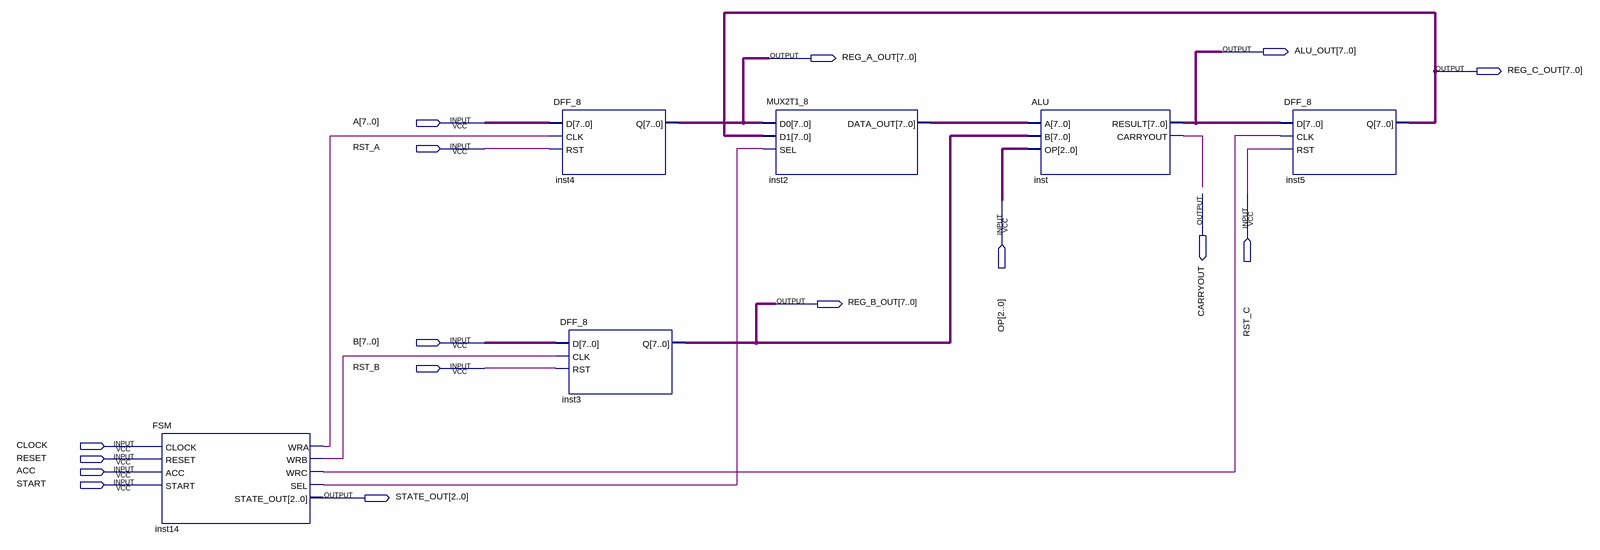
[diagram p0: schematic sheet]
// Quartus schematic DATA_FLOW.bdf as structural Verilog: 6 symbols, 16 pins
module DATA_FLOW (
  input  [7:0] A,
  input  RST_A,
  input  RST_C,
  input  [2:0] OP,
  input  [7:0] B,
  input  RST_B,
  input  CLOCK,
  input  RESET,
  input  ACC,
  input  START,
  output [7:0] ALU_OUT,
  output [7:0] REG_A_OUT,
  output [7:0] REG_C_OUT,
  output CARRYOUT,
  output [7:0] REG_B_OUT,
  output [2:0] STATE_OUT
);

  wire inst14_sel, inst14_wra, inst14_wrb, inst14_wrc, inst_carryout;
  wire [7:0] inst2_data_out;

  FSM inst14 (
    .CLOCK(CLOCK), .RESET(RESET), .ACC(ACC), .START(START), .WRA(inst14_wra), .WRB(inst14_wrb),
    .WRC(inst14_wrc), .SEL(inst14_sel), .STATE_OUT(STATE_OUT));
  DFF_8 inst4 (.D(A), .CLK(inst14_wra), .RST(RST_A), .Q(REG_A_OUT));
  DFF_8 inst3 (.D(B), .CLK(inst14_wrb), .RST(RST_B), .Q(REG_B_OUT));
  MUX2T1_8 inst2 (.D0(REG_A_OUT), .D1(REG_C_OUT), .SEL(inst14_sel), .DATA_OUT(inst2_data_out));
  ALU inst (.A(inst2_data_out), .B(REG_B_OUT), .OP(OP), .RESULT(ALU_OUT), .CARRYOUT(inst_carryout));
  DFF_8 inst5 (.D(ALU_OUT), .CLK(inst14_wrc), .RST(RST_C), .Q(REG_C_OUT));
endmodule
